# Altium schematic sheet TPS40210DGQ.SchDoc
size A
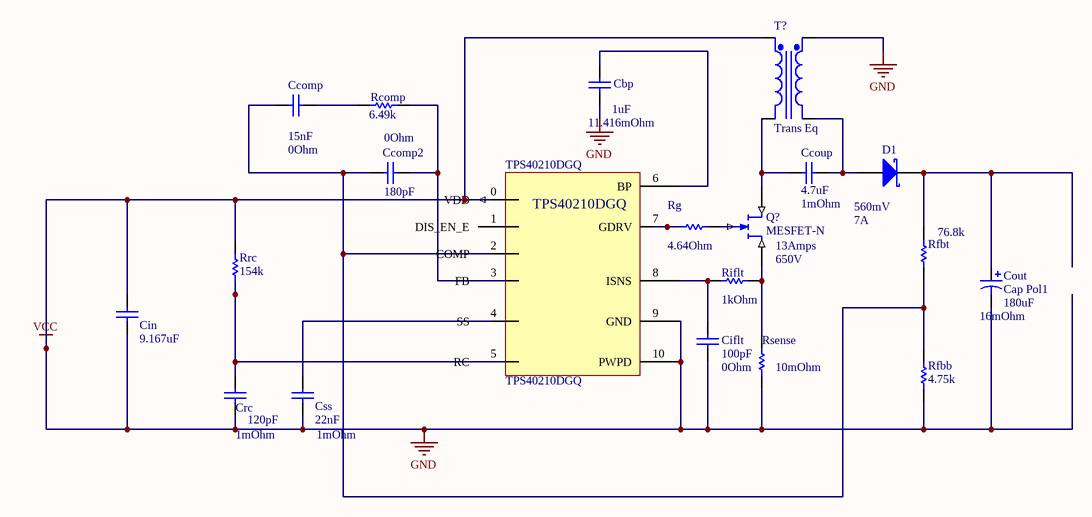
[diagram p0: TPS40210DGQ.SchDoc]

## Parts
120pF  Crc  value 120pF  value 1mOhm  [RAD-0.3]
?  Css  value 22nF  value 1mOhm  [RAD-0.3]
Capacitor  Cin  value 9.167uF  [RAD-0.3]
Cbp  value 1uF  value 11.416mOhm  [RAD-0.3]  (hidden comment: Css)
Ccomp  value 15nF  value 0Ohm  [RAD-0.3]
Ccomp2  value 180pF  value 0Ohm  [RAD-0.3]  (hidden comment: Ccomp2)
Ccoup  value 4.7uF  value 1mOhm  [RAD-0.3]  (hidden comment: Css)
Ciflt  value 100pF  value 0Ohm  [RAD-0.3]  (hidden comment: Css)
Cout  Cap Pol1  value 180uF  [RB7.6-15]
D1  Diode 10TQ040  [TO-220AC]  (value not drawn)
Q?  MESFET-N  voltage: 650V  I: 13Amps  [TO-18]
Rcomp  Rrc: 6.49k  [AXIAL-0.3]  (hidden comment: Res1)
Rfbb  Rfbt: 4.75k  [AXIAL-0.3]  (hidden comment: Res1)
Rfbt  Rfbt: 76.8k  [AXIAL-0.3]  (hidden comment: Res1)
Rg  Rrc: 4.64Ohm  [AXIAL-0.3]  (hidden comment: Res1)
Riflt  Rrc: 1kOhm  [AXIAL-0.3]  (hidden comment: Res1)
Rrc  Rrc: 154k  [AXIAL-0.3]  (hidden comment: Res1)
Rsense  Rrc: 10mOhm  [AXIAL-0.3]  (hidden comment: Res1)
T?  Trans Eq  [TRF_4]
TPS40210DGQ  TPS40210DGQ

## Nets
GND: 120pF.2 ?.2 Capacitor.1 Capacitor.2 Cbp.2 Ciflt.2 Cout.2 Rfbb.2 Rrc.2 Rsense.2 T?.1(Pri+) T?.3(Sec+) TPS40210DGQ.9(GND) TPS40210DGQ.10(PWPD)  [also labelled VCC]
Net120pF_1: 120pF.1 Rrc.1
NetCbp_1: Cbp.1 TPS40210DGQ.6(BP)
NetCcomp2_2: Ccomp2.2 Rcomp.1
NetCcomp_1: Ccomp.1 Ccomp2.1 Rfbb.1 Rfbt.2
NetCcomp_2: Ccomp.2 Rcomp.2
NetCcoup_1: Ccoup.1 Q?.1(D) T?.2(Pri-)
NetCcoup_2: Ccoup.2 D1.3(A) T?.4(Sec-)
NetCiflt_1: Ciflt.1 Riflt.2 TPS40210DGQ.8(ISNS)
NetCout_1: Cout.1 D1.1(K) Rfbt.1
NetQ?_3: Q?.3(S) Riflt.1 Rsense.1
NetRg_2: Rg.2 TPS40210DGQ.7(GDRV)

Not connected (* = marked no-connect by the designer): ? 1; Q? 2(G); Rg 1; TPS40210DGQ 0(VDD) 1(DIS_EN_E) 2(COMP) 3(FB) 4(SS) 5(RC)

## Notes on the sheet
- (in symbol Cap Pol1) 16mOhm
- (in symbol Diode 10TQ040) 560mV; 7A

## Library data of the parts
120pF ? Capacitor Cbp Ccomp Ccomp2 Ccoup Ciflt = Cap: Capacitor; Published: 8-Jun-2000; LatestRevisionDate: 17-Jul-2002; LatestRevisionNote: Re-released for DXP Platform.; PackageReference: RAD-0.3; Publisher: Altium Limited; PackageDescription: Radial Cap, Thru-Hole; 2 Leads; 0.3 in Pin Spacing
Cout = Cap Pol1: Polarized Capacitor (Radial); Published: 8-Jun-2000; LatestRevisionDate: 17-Jul-2002; LatestRevisionNote: Re-released for DXP Platform.; PackageReference: RB7.6-15; Publisher: Altium Limited; PackageDescription: Polarized Capacitor (Radial); 2 Leads
D1 = Diode 10TQ040: Schottky Rectifier; Note: Terminal 2 is the TAB and is electrically connected to the cathode; Published: 8-Jun-2000; LatestRevisionDate: 17-Jul-2002; LatestRevisionNote: Re-released for DXP Platform.; DatasheetVersion: PD-2.057B; PackageVersion: Feb-1998; PackageReference: TO-220AC; Publisher: Altium Limited; PackageDescription: TO, Thru-Hole, Vertical, Heatsink Mounted; 3 In-Line Leads (1 Absent); Pitch 2.54 mm; ComponentLink1Description: Manufacturer Link; ComponentLink1URL: http://www.irf.com/
Q? = MESFET-N: N-Channel MESFET; Published: 8-Jun-2000; LatestRevisionDate: 17-Jul-2002; LatestRevisionNote: Re-released for DXP Platform.; PackageReference: TO-18; Publisher: Altium Limited; PackageDescription: Can; 3 Leads; Pin Circle Dia. 2.54 mm; Lead Dia. 0.48 mm (max); Code_JEDEC: TO-18
Rcomp Rfbb Rfbt Rg Riflt Rrc Rsense = Res1: Resistor; Published: 8-Jun-2000; LatestRevisionDate: 17-Jul-2002; LatestRevisionNote: Re-released for DXP Platform.; PackageReference: AXIAL-0.3; Publisher: Altium Limited; PackageDescription: Axial Device, Thru-Hole; 2 Leads; 0.3 in Pin Spacing
T? = Trans Eq: Transformer (Equivalent Circuit Model); Published: 8-Jun-2000; LatestRevisionDate: 17-Jul-2002; LatestRevisionNote: Re-released for DXP Platform.; PackageReference: TRF_4; Publisher: Altium Limited; PackageDescription: Transformer; 4 Leads